# EAGLE design BATT_CPU_V4 (EAGLE 9.6.2)
COMPANY: ADAFRUIT INDUSTRIES; DRAWN: KTOWN; REV: B
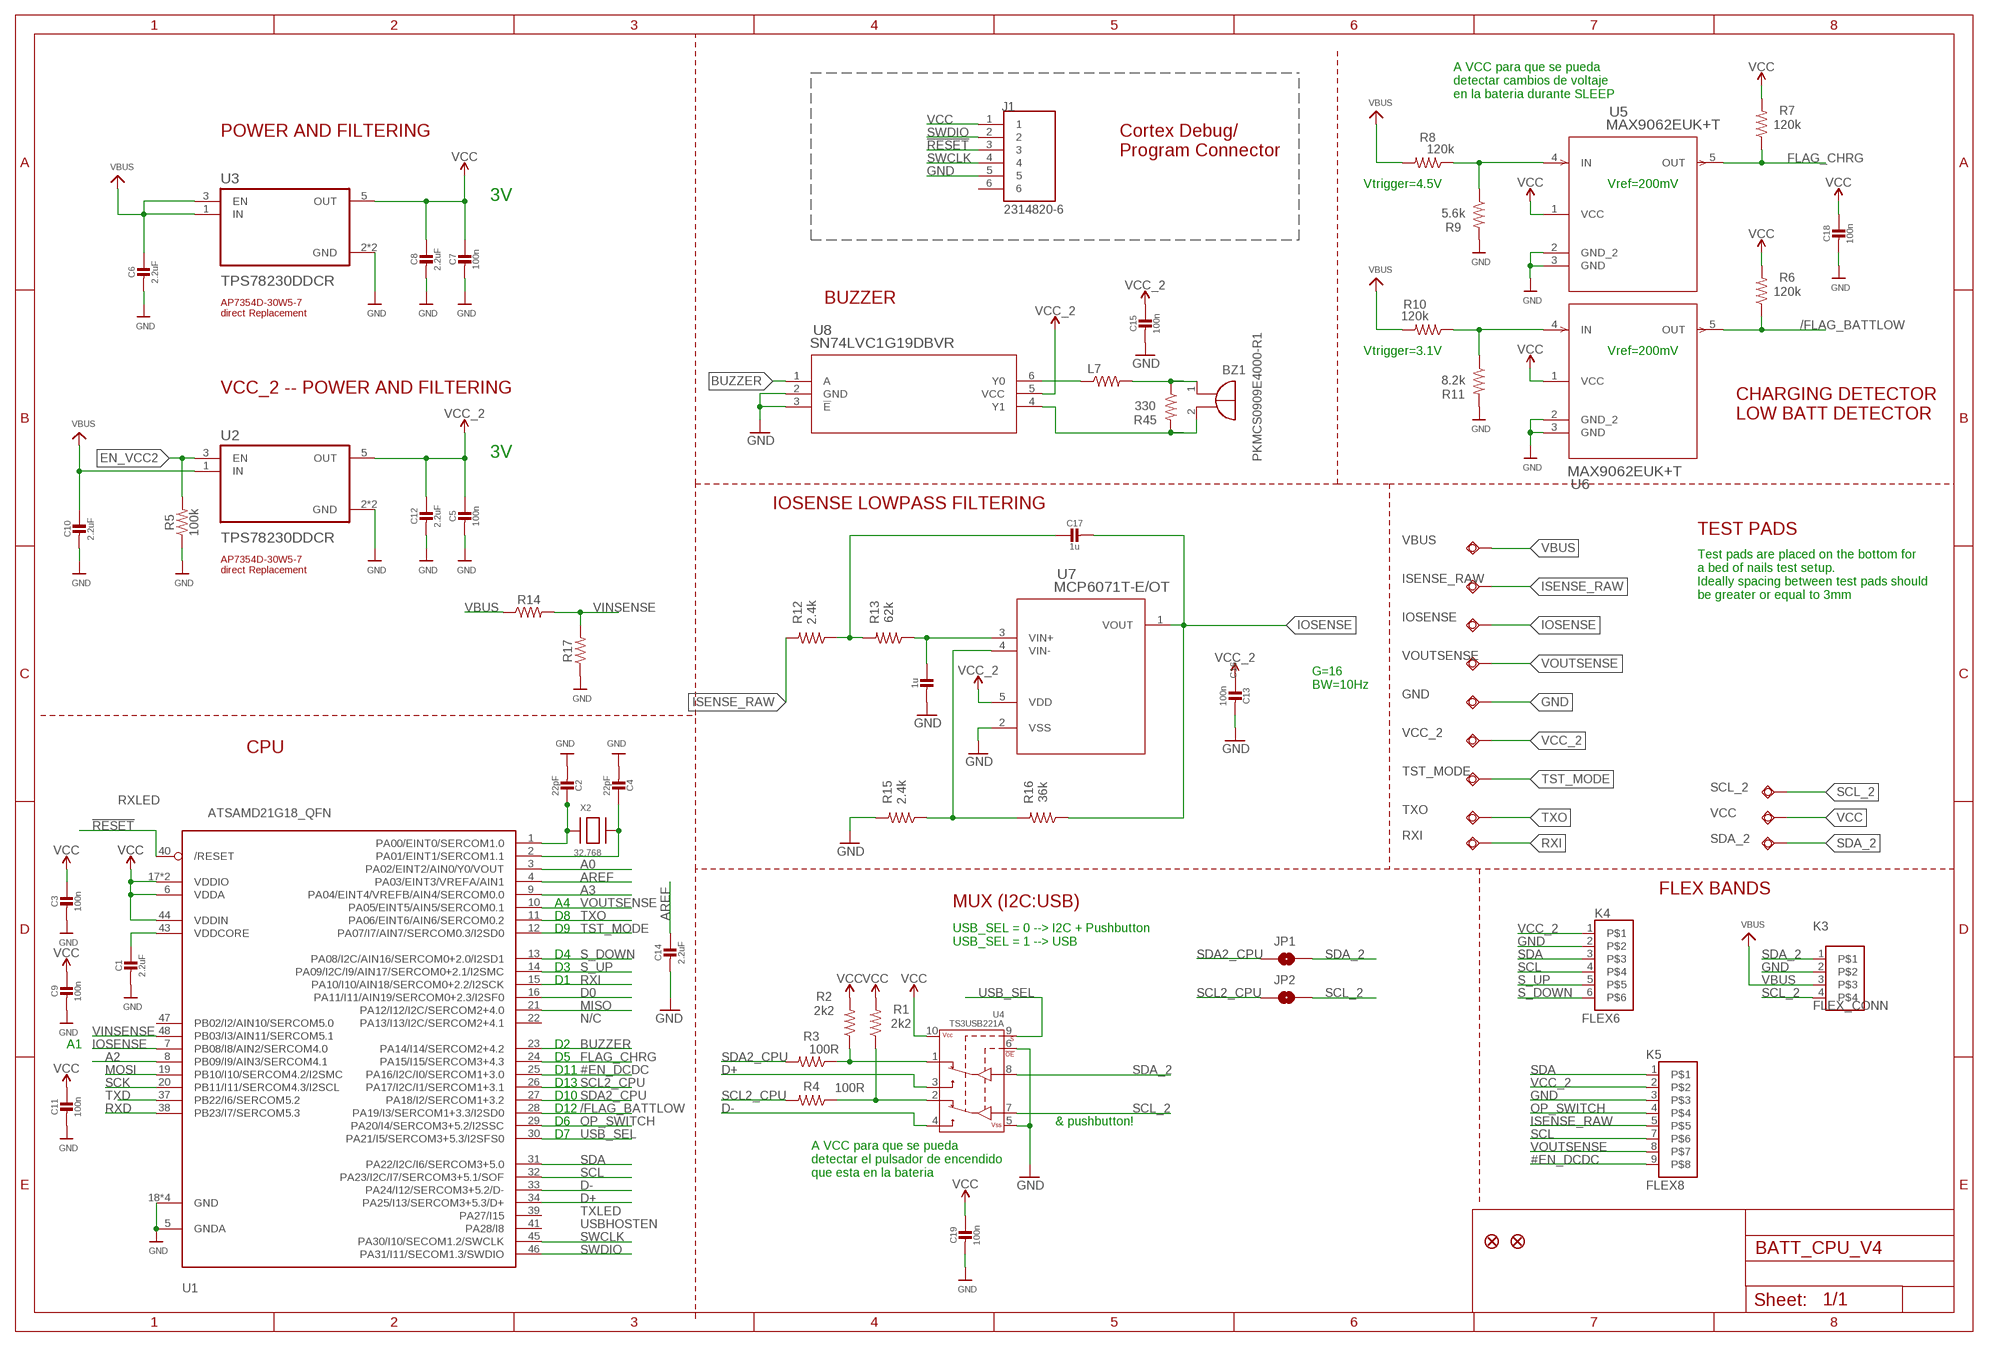
[diagram p0: schematic, sheet 1]

## Parts
BZ1  PKMCS0909E4000-R1  [PKMCS0909]
C1  2.2uF  CAP_CERAMIC0603_NO  [0603-NO]
C2  22pF  CAP_CERAMIC0603_NO  [0603-NO]
C3  100n  CAP_CERAMIC0603_NO  [0603-NO]
C4  22pF  CAP_CERAMIC0603_NO  [0603-NO]
C5  100n  CAP_CERAMIC0603_NO  [0603-NO]
C6  2.2uF  CAP_CERAMIC0805-NOOUTLINE  [0805-NO]
C7  100n  CAP_CERAMIC0603_NO  [0603-NO]
C8  2.2uF  CAP_CERAMIC0805-NOOUTLINE  [0805-NO]
C9  100n  CAP_CERAMIC0603_NO  [0603-NO]
C10  2.2uF  CAP_CERAMIC0805-NOOUTLINE  [0805-NO]
C11  100n  CAP_CERAMIC0603_NO  [0603-NO]
C12  2.2uF  CAP_CERAMIC0805-NOOUTLINE  [0805-NO]
C13  100n  CAP_CERAMIC0603_NO  [0603-NO]
C14  2.2uF  CAP_CERAMIC0603_NO  [0603-NO]
C15  100n  CAP_CERAMIC0603_NO  [0603-NO]
C16  1u  CAP_CERAMIC0603_NO  [0603-NO]
C17  1u  CAP_CERAMIC0603_NO  [0603-NO]
C18  100n  CAP_CERAMIC0603_NO  [0603-NO]
C19  100n  CAP_CERAMIC0603_NO  [0603-NO]
GND  TESTPAD_TPSQB1,27  [TESTPAD_B1,27]
IOSENSE  TESTPAD_TPSQB1,27  [TESTPAD_B1,27]
ISENSE_RAW  TESTPAD_TPSQB1,27  [TESTPAD_B1,27]
J1  2314820-6  [TE_2314820-6]
JP1  JUMPER-SMT_2_NO_SILK  [SMT-JUMPER_2_NO_SILK]
JP2  JUMPER-SMT_2_NO_SILK  [SMT-JUMPER_2_NO_SILK]
K3  FLEX_CONN  FLEX4  [FLEX4]
K4  FLEX6  [FLEX6]
K5  FLEX8  [FLEX8]
L7  MMZ2012Y202BT000  RESISTOR0805-RES  [0805]
R1  2k2  RESISTOR0603  [0603]
R2  2k2  RESISTOR0603  [0603]
R3  100R  RESISTOR0603  [0603]
R4  100R  RESISTOR0603  [0603]
R5  100k  RESISTOR0603  [0603]
R6  120k  RESISTOR0603  [0603]
R7  120k  RESISTOR0603  [0603]
R8  120k  RESISTOR0603  [0603]
R9  5.6k  RESISTOR0603  [0603]
R10  120k  RESISTOR0603  [0603]
R11  8.2k  RESISTOR0603  [0603]
R12  2.4k  RESISTOR0603  [0603]
R13  62k  RESISTOR0603  [0603]
R14  RESISTOR0603  [0603]
R15  2.4k  RESISTOR0603  [0603]
R16  36k  RESISTOR0603  [0603]
R17  RESISTOR0603  [0603]
R45  330  RESISTOR0603  [0603]
RXI  TESTPAD_TPSQB1,27  [TESTPAD_B1,27]
SCL_2  TESTPAD_TPSQB1,27  [TESTPAD_B1,27]
SDA_2  TESTPAD_TPSQB1,27  [TESTPAD_B1,27]
TST_MODE  TESTPAD_TPSQB1,27  [TESTPAD_B1,27]
TXO  TESTPAD_TPSQB1,27  [TESTPAD_B1,27]
U1  ATSAMD21G18_QFN  ATSAMD21J_QFN  [TQFN48_7MM]
U2  TPS78230DDCR  [SOT95P280X110-5N]
U3  TPS78230DDCR  [SOT95P280X110-5N]
U4  TS3USB221A  [QFN-10-RSE]
U5  MAX9062EUK+T  [21-0057F_MXM]
U6  MAX9062EUK+T  [21-0057F_MXM]
U7  MCP6071T-E/OT  [SOT-23-5_MC_MCH]
U8  SN74LVC1G19DBVR  [DBV6]
U$34  FIDUCIAL""  [FIDUCIAL_1MM]
U$35  FIDUCIAL""  [FIDUCIAL_1MM]
VBUS  TESTPAD_TPSQB1,27  [TESTPAD_B1,27]
VCC  TESTPAD_TPSQB1,27  [TESTPAD_B1,27]
VCC_2  TESTPAD_TPSQB1,27  [TESTPAD_B1,27]
VOUTSENSE  TESTPAD_TPSQB1,27  [TESTPAD_B1,27]
X2  32.768  XTAL-3.2X1.5  [XTAL3215]

## Nets
!RESET: J1.3 U1.40(/RESET)
#EN_DCDC: K5.9 U1.25(PA16/I2C/I0/SERCOM1+3.0)
/FLAG_BATTLOW: R6.1 U1.28(PA19/I3/SERCOM1+3.3/I2SD0) U6.5(OUT)
A0: U1.3(PA02/EINT2/AIN0/Y0/VOUT)
A2: U1.8(PB09/I9/AIN3/SERCOM4.1)
A3: U1.9(PA04/EINT4/VREFB/AIN4/SERCOM0.0)
AREF: C14.1 U1.4(PA03/EINT3/VREFA/AIN1)
BUZZER: U1.23(PA14/I14/SERCOM2+4.2) U8.1(A)
D0: U1.16(PA11/I11/AIN19/SERCOM0+2.3/I2SF0)
D+: U1.34(PA25/I13/SERCOM3+5.3/D+) U4.3(2D+)
D-: U1.33(PA24/I12/SERCOM3+5.2/D-) U4.4(2D-)
EN_VCC2: R5.2 U2.3(EN)
FLAG_CHRG: R7.1 U1.24(PA15/I15/SERCOM3+4.3) U5.5(OUT)
GND: C1.2 C2.2 C3.2 C4.2 C5.2 C6.2 C7.2 C8.2 C9.2 C10.2 C11.2 C12.2 C13.2 C14.2 C15.2 C16.2 C18.2 C19.2 GND.TP J1.5 K3.2 K4.2 K5.3 R5.1 R9.2 R11.2 R15.2 R17.1 U1.5(GNDA) U1.18(GND) U1.35(GND) U1.42(GND) U1.THERMAL(GND) U2.2(GND) U2.4(GND) U3.2(GND) U3.4(GND) U4.5(VSS) U4.6(!OE) U5.2(GND_2) U5.3(GND) U6.2(GND_2) U6.3(GND) U7.2(VSS) U8.2(GND) U8.3(!E)
IOSENSE: C17.2 IOSENSE.TP R16.1 U1.7(PB08/I8/AIN2/SERCOM4.0) U7.1(VOUT)
ISENSE_RAW: ISENSE_RAW.TP K5.5 R12.2
MISO: U1.21(PA12/I12/I2C/SERCOM2+4.0)
MOSI: U1.19(PB10/I10/SERCOM4.2/I2SMC)
N$1: R15.1 R16.2 U7.4(VIN-)
N$2: R2.1 R3.1 U4.1(1D+)
N$3: R1.1 R4.1 U4.2(1D-)
N$4: U1.37(PB22/I6/SERCOM5.2)
N$5: C2.1 U1.1(PA00/EINT0/SERCOM1.0) X2.P$1
N$6: U1.38(PB23/I7/SERCOM5.3)
N$7: C4.1 U1.2(PA01/EINT1/SERCOM1.1) X2.P$2
N$8: C17.1 R12.1 R13.2
N$10: R10.1 R11.1 U6.4(IN)
N$11: R8.1 R9.1 U5.4(IN)
N$13: C16.1 R13.1 U7.3(VIN+)
N$17: L7.1 U8.6(Y0)
N$19: BZ1.1(+) L7.2 R45.1
N$22: BZ1.2(-) R45.2 U8.4(Y1)
OP_SWITCH: K5.4 U1.29(PA20/I4/SERCOM3+5.2/I2SSC)
RXI: RXI.TP U1.15(PA10/I10/AIN18/SERCOM0+2.2/I2SCK)
S_DOWN: K4.6 U1.13(PA08/I2C/AIN16/SERCOM0+2.0/I2SD1)
S_UP: K4.5 U1.14(PA09/I2C/I9/AIN17/SERCOM0+2.1/I2SMC)
SCK: U1.20(PB11/I11/SERCOM4.3/I2SCL)
SCL: K4.4 K5.7 U1.32(PA23/I2C/I7/SERCOM3+5.1/SOF)
SCL2_CPU: JP2.1 R4.2 U1.26(PA17/I2C/I1/SERCOM1+3.1)
SCL_2: JP2.2 K3.4 SCL_2.TP U4.7(D-)
SDA: K4.3 K5.1 U1.31(PA22/I2C/I6/SERCOM3+5.0)
SDA2_CPU: JP1.1 R3.2 U1.27(PA18/I2/SERCOM1+3.2)
SDA_2: JP1.2 K3.1 SDA_2.TP U4.8(D+)
SWCLK: J1.4 U1.45(PA30/I10/SECOM1.2/SWCLK)
SWDIO: J1.2 U1.46(PA31/I11/SECOM1.3/SWDIO)
TST_MODE: TST_MODE.TP U1.12(PA07/I7/AIN7/SERCOM0.3/I2SD0)
TXO: TXO.TP U1.11(PA06/EINT6/AIN6/SERCOM0.2)
USB_SEL: U1.30(PA21/I5/SERCOM3+5.3/I2SFS0) U4.9(S)
VBUS: C6.1 C10.1 K3.3 R8.2 R10.2 R14.1 U2.1(IN) U3.1(IN) U3.3(EN) VBUS.TP
VCC: C3.1 C7.1 C8.1 C9.1 C11.1 C18.1 C19.1 J1.1 R1.2 R2.2 R6.2 R7.2 U1.6(VDDA) U1.17(VDDIO) U1.36(VDDIO) U1.44(VDDIN) U3.5(OUT) U4.10(VCC) U5.1(VCC) U6.1(VCC) VCC.TP
VCC_2: C5.1 C12.1 C13.1 C15.1 K4.1 K5.2 U2.5(OUT) U7.5(VDD) U8.5(VCC) VCC_2.TP
VDDCORE: C1.1 U1.43(VDDCORE)
VINSENSE: R14.2 R17.2 U1.48(PB03/I3/AIN11/SERCOM5.1)
VOUTSENSE: K5.8 U1.10(PA05/EINT5/AIN5/SERCOM0.1) VOUTSENSE.TP
Unconnected: J1.6 U1.22(PA13/I13/I2C/SERCOM2+4.1) U1.39(PA27/I15) U1.41(PA28/I8) U1.47(PB02/I2/AIN10/SERCOM5.0)

## Notes on the sheet
- A VCC para que se pueda
  detectar cambios de voltaje
  en la bateria durante SLEEP
- Cortex Debug/
  Program Connector
- POWER AND FILTERING
- Vtrigger=4.5V | Vref=200mV
- 3V
- BUZZER
- AP7354D-30W5-7 
  direct Replacement
- Vtrigger=3.1V | Vref=200mV
- VCC_2 -- POWER AND FILTERING
- CHARGING DETECTOR
  LOW BATT DETECTOR
- 3V
- IOSENSE LOWPASS FILTERING
- TEST PADS
- AP7354D-30W5-7 
  direct Replacement
- Test pads are placed on the bottom for
  a bed of nails test setup.
  Ideally spacing between test pads should 
  be greater or equal to 3mm
- G=16
  BW=10Hz
- CPU
- RXLED
- FLEX BANDS
- A4 | MUX (I2C:USB)
- D8
- D9
- USB_SEL = 0 --> I2C + Pushbutton
  USB_SEL = 1 --> USB
- D4
- D3
- D1
- N/C
- A1 | D2
- D5
- D11
- D13
- TXD | D10
- RXD | D12
- D6 | & pushbutton!
- D7
- A VCC para que se pueda
  detectar el pulsador de encendido
  que esta en la bateria
- TXLED
- USBHOSTEN

## Library data of the parts
BZ1 = buzzer:PKMCS0909E4000-R1: PKMCS0909E4000-R1 Source : http://www.murata.com/~/media/webrenewal/products/sound/sounder/vppt-buzj083-d.ashx
C1-C19 = microbuilder:CAP_CERAMIC: Ceramic Capacitors For new designs, use the packages preceded by an '_' character since they are more reliable: The following footprints should be used on most boards: _0402 - Standard footprint for regular board layouts _0603 - Standard footprint for regular board layouts _0805 - Standard footprint for regular board layouts _1206 - Standard footprint for regular board layouts For extremely tight-pitch boards where space is at a premium, the following 'micro-pitch' footprints can be used (smaller pads, no silkscreen outline, etc.): _0402MP - Micro-pitch footprint for very dense/compact boards _0603MP - Micro-pitch footprint for very dense/compact boards _0805MP - Micro-pitch footprint for very dense/compact boards _1206MP - Micro-pitch footprint for very dense/compact boards
GND IOSENSE ISENSE_RAW RXI SCL_2 SDA_2 TST_MODE TXO VBUS VCC VCC_2 VOUTSENSE = BeagleBone_Blue_R3:TESTPAD_TPSQ: Test pad
J1 = connector 2x3-2mm:2314820-6; COMMENT: 2314820-6; DESCRIPTION: Socket Receptacle 6P,2MM,B-B,REC,DRVT,2.7,0.1AU,TB 6 POS; DIGI-KEY_PART_NUMBER: 17-2314820-6-ND; MF: TE Connectivity; MP: 2314820-6; PACKAGE: None; PURCHASE-URL: https://pricing.snapeda.com/search/part/2314820-6/?ref=eda
JP1 JP2 = SparkFun-Jumpers:JUMPER-SMT_2_NO: Normally open jumper This jumper has two pads in close proximity to each other. Apply solder to close the connection. Round pads are easier to solder for beginners, but are a lot larger. SparkFun Product that uses the round pads: SparkFun EL Sequencer <https://www.sparkfun.com/products/12781>
K3 = Flex_3mm:FLEX4
K4 = Flex_3mm:FLEX6: WR-FPC 1mm SMT Horiz. Bot. Contact Hinge type WR-FPC 1mm 06 pins Hinge type SMT Horizontal Bottom Contact ;=>Code : Con_FPC_ZIF_1.00_6861xx148922_686106148922 <http://katalog.we-online.de/media/images/eican/Con_FPC_ZIF_1.00_686110148922_pf2.jpg> Details see: http://katalog.we-online.de/em/datasheet/6861xx148922.pdf Created 2014-10-08, Karrer Zheng 2014 (C) Wurth Elektronik
K5 = Flex_3mm:FLEX8: WR-FPC 1mm SMT Horiz. Bot. Contact Hinge type WR-FPC 1mm 08 pins Hinge type SMT Horizontal Bottom Contact ;=>Code : Con_FPC_ZIF_1.00_6861xx148922_686108148922 <http://katalog.we-online.de/media/images/eican/Con_FPC_ZIF_1.00_686110148922_pf2.jpg> Details see: http://katalog.we-online.de/em/datasheet/6861xx148922.pdf Created 2014-10-08, Karrer Zheng 2014 (C) Wurth Elektronik
L7 = SparkFun:RESISTOR: Resistor Basic schematic elements and footprints for 0603, 1206, and PTH resistors.
R1-R17 R45 = SparkFun-Resistors:RESISTOR: Generic Resistor Package
U1 = microbuilder:ATSAMD21J
U2 U3 = TPS78230DDCR:TPS78230DDCR: Check prices <https://pricing.snapeda.com/parts/TPS78230DDCR/Texas%20Instruments/view-part?ref=eda>; AVAILABILITY: Good; DESCRIPTION: 150-mA, nano-IQ, low-dropout voltage regulator with enable from -40C to +125C 5-SOT-23-THIN -40 to 125; MF: Texas Instruments; MP: TPS78230DDCR; PACKAGE: SOT-23-THN-5 Texas Instruments; PRICE: None; PURCHASE-URL: https://pricing.snapeda.com/search/part/TPS78230DDCR/?ref=eda
U4 = SparkFun-IC-Special-Function:TS3USB221A: DPDT Analog Mux DPDT Analog Mux Vcc 2.5 to 3.3V Passes up to 5.5V at 3.3V supply 900MHz BW, 6Ω switch resistance SparkFun Products SparkFun FTDI SmartBasic <https://www.sparkfun.com/products/12935> (DEV-12935); PROD_ID: IC-12115
U5 U6 = MAX9062:MAX9062EUK+T; BUILT_BY: EMA_UL_Team; MANUFACTURER_PART_NUMBER: MAX9062EUK+T; SOURCELIBRARY: Maxim_2014-06-20; VENDOR: Maxim Integrated Products
U7 = MCP6071:MCP6071T-E/OT; BUILT_BY: EMA_Jessica; COPYRIGHT: Copyright (C) 2018 Accelerated Designs. All rights reserved; MANUFACTURER_PART_NUMBER: MCP6071T-E/OT; SOURCELIBRARY: Microchip_2019-08-23_21; VENDOR: Microchip
U8 = SN74LVC1G19DBVR:SN74LVC1G19DBVR; DATASHEET_URL: http://www.ti.com/lit/gpn/SN74LVC1G19; DESCRIPTION: 1-of-2 Decoder/Demultiplexer; FAMILY_NAME: LL Decoder, Mux/Demux; GENERIC_PART_NUMBER: SN74LVC1G19; INDUSTRY_STD_PKG_TYPE: SOT-23; MANUFACTURER: Texas Instruments; MANUFACTURER_PART_NUMBER: SN74LVC1G19DBVR; PACKAGE_DESIGNATOR: DBV; PIN_COUNT: 6; VENDOR: Texas Instruments
U$34 U$35 = microbuilder:FIDUCIAL: Fiducial Alignment Points Various fiducial points for machine vision alignment.; BOM: EXCLUDE
X2 = adafruit2:XTAL: Low cost SMT crystals, no capacitors included http://www.ladyada.net/library/eagle

## Net classes
2 gnd: width 0.305 mm, drill 0.483 mm, clearance 0.203 mm

## Board
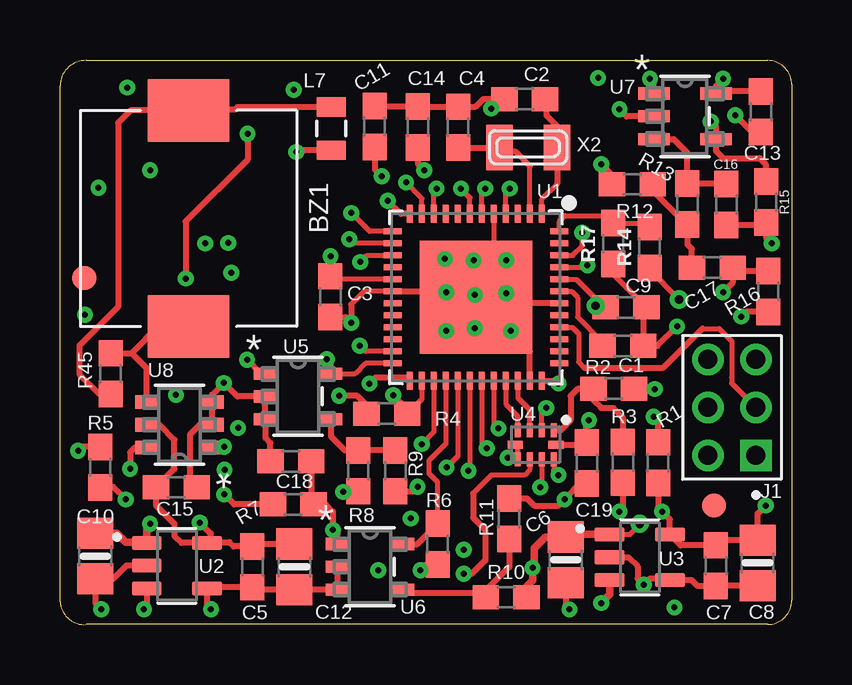
[diagram p1: board, top side]
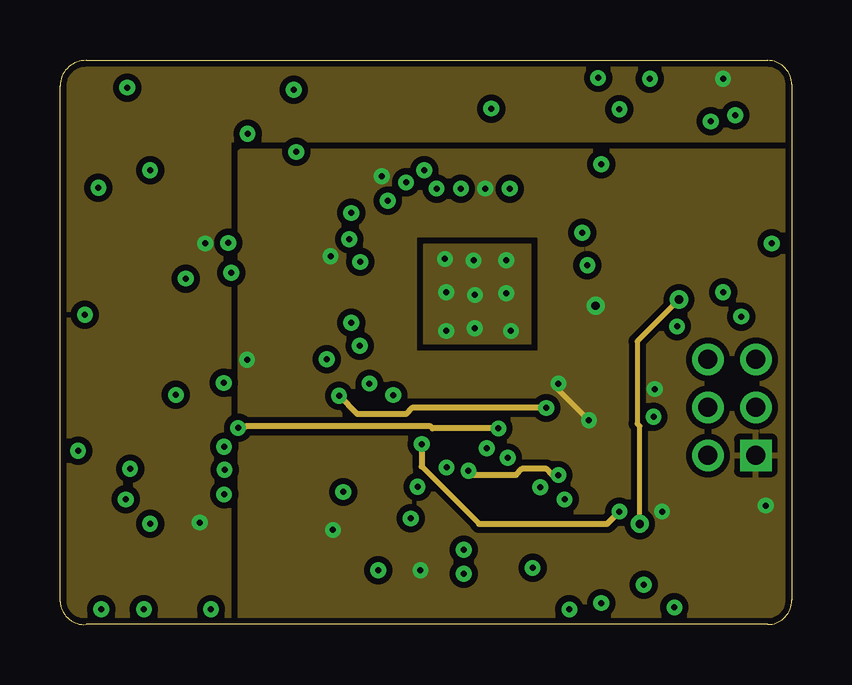
[diagram p2: board, inner layer Route2]
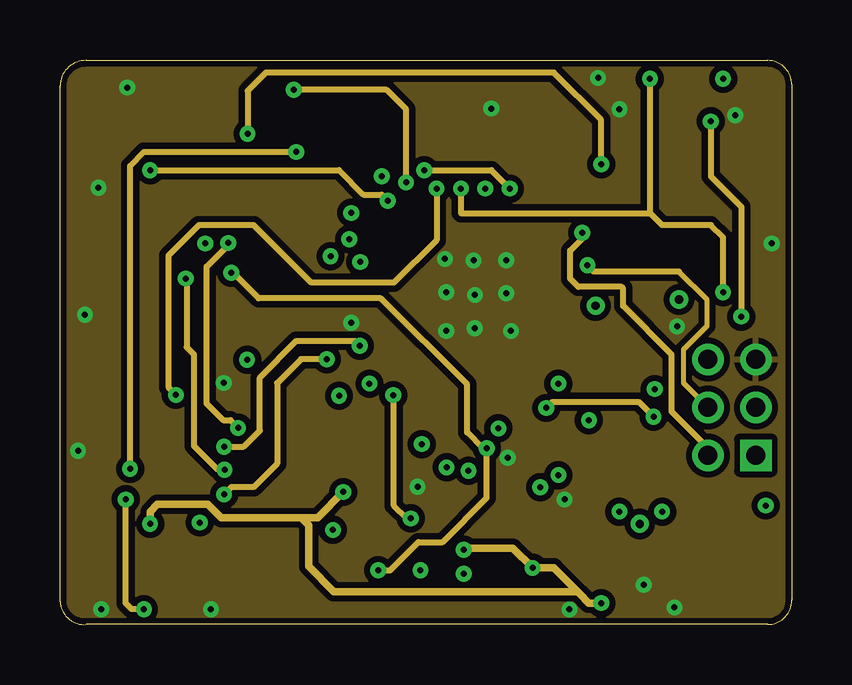
[diagram p3: board, inner layer Route15]
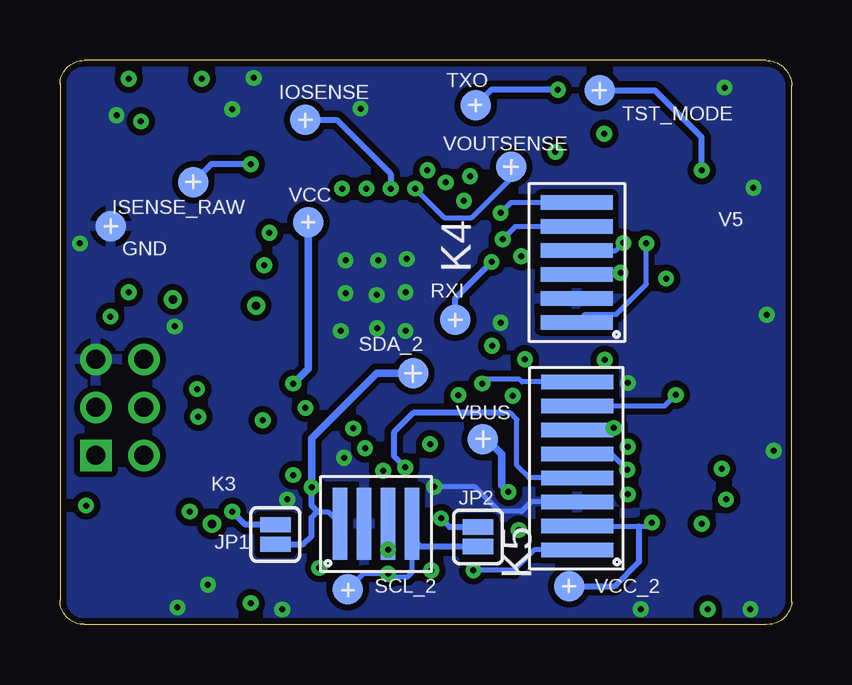
[diagram p4: board, bottom side, seen from below]

Size 30.49 x 23.5 mm. Coordinates in mm from the lower left corner, seen from the top.
Outline: 1.09,23.5 29.49,23.5 arc-90 30.49,22.5 30.49,1 arc-90 29.49,0 1.09,0 arc-90 0,0.95 0,22.45 arc-90 1.09,23.5
Copper layers (1+2*15+16): Top 0.035mm / dielectric 1.5mm / Route2 0.035mm / dielectric 0.15mm / Route15 0.035mm / dielectric 0.2mm / Bottom 0.035mm
Design rules "adafruit *": minimum track width 8mil, minimum drill 0.25mm, track to track 10mil, track to pad 10mil, pad to pad 10mil, via to via 10mil, smd to smd 8mil, copper to edge 10mil, drill to drill 8mil, minimum pad ring 10mil, minimum via ring 8mil, stop-mask expansion 2mil, vias tented up to drill 20mil, thermal gap 10mil

### Footprints (pad centres in the part's own frame; a part is rotated, then mirrored left to right if it is on the bottom)
PKMCS0909 = smd 2.6 x 3.4: 1 -4.5,0; 2 4.5,0
0603-NO = smd 1.1 x 1: 1 -0.85,0; 2 0.85,0
0805-NO = smd 1.3 x 1.5: 1 -0.95,0; 2 0.95,0
TESTPAD_B1,27 = smd 1.27 x 1.27: TP 0,0
TE_2314820-6 = drill 0.8 pad 1.15 square: 1 0,0 | drill 0.8 pad 1.15: 2 0,2; 3 2,0; 4 2,2; 5 4,0; 6 4,2
SMT-JUMPER_2_NO_SILK = smd 0.635 x 1.27: 1 -0.406,0; 2 0.406,0
FLEX4 = smd 0.6 x 3: 1 0.3,1.85; 2 1.3,1.85; 3 2.3,1.85; 4 3.3,1.85
FLEX6 = smd 0.6 x 3: 1 -2.5,-0.35; 2 -1.5,-0.35; 3 -0.5,-0.35; 4 0.5,-0.35; 5 1.5,-0.35; 6 2.5,-0.35
FLEX8 = smd 0.6 x 3: 1 0.8,2.05; 2 1.8,2.05; 3 2.8,2.05; 4 3.8,2.05; 5 4.8,2.05; 7 5.8,2.05; 8 6.8,2.05; 9 7.8,2.05
0805 = smd 0.8 x 1.2: 1 -0.9,0; 2 0.9,0
0603 = smd 1.1 x 1: 1 -0.85,0; 2 0.85,0
TQFN48_7MM = smd 0.25 x 0.75: 1 -2.75,-3.475; 2 -2.25,-3.475; 3 -1.75,-3.475; 4 -1.25,-3.475; 5 -0.75,-3.475; 6 -0.25,-3.475; 7 0.25,-3.475; 8 0.75,-3.475; 9 1.25,-3.475; 10 1.75,-3.475; 11 2.25,-3.475; 12 2.75,-3.475; 25 2.75,3.475; 26 2.25,3.475; 27 1.75,3.475; 28 1.25,3.475; 29 0.75,3.475; 30 0.25,3.475; 31 -0.25,3.475; 32 -0.75,3.475; 33 -1.25,3.475; 34 -1.75,3.475; 35 -2.25,3.475; 36 -2.75,3.475 | smd 0.75 x 0.25: 13 3.475,-2.75; 14 3.475,-2.25; 15 3.475,-1.75; 16 3.475,-1.25; 17 3.475,-0.75; 18 3.475,-0.25; 19 3.475,0.25; 20 3.475,0.75; 21 3.475,1.25; 22 3.475,1.75; 23 3.475,2.25; 24 3.475,2.75; 37 -3.475,2.75; 38 -3.475,2.25; 39 -3.475,1.75; 40 -3.475,1.25; 41 -3.475,0.75; 42 -3.475,0.25; 43 -3.475,-0.25; 44 -3.475,-0.75; 45 -3.475,-1.25; 46 -3.475,-1.75; 47 -3.475,-2.25; 48 -3.475,-2.75 | smd 4.7 x 4.7: THERMAL 0,0
SOT95P280X110-5N = smd 1.25 x 0.59: 1 -1.255,0.95; 2 -1.255,0; 3 -1.255,-0.95; 4 1.255,-0.95; 5 1.255,0.95
QFN-10-RSE = smd 0.58 x 0.25: 1 -0.6,0.75; 2 -0.6,0.25; 3 -0.6,-0.25; 4 -0.6,-0.75; 6 0.6,-0.75; 7 0.6,-0.25; 8 0.6,0.25; 9 0.6,0.75 | smd 0.35 x 0.63: 5 0,-0.85; 10 0,0.85
21-0057F_MXM = smd 0.972 x 0.508: 1 -1.362,0.95; 2 -1.362,0; 3 -1.362,-0.95; 4 1.362,-0.95; 5 1.362,0.95
SOT-23-5_MC_MCH = smd 1.31 x 0.508: 1 -1.295,0.95; 2 -1.295,0; 3 -1.295,-0.95; 4 1.295,-0.95; 5 1.295,0.95
DBV6 = smd 0.972 x 0.568: 1 -1.362,0.95; 2 -1.362,0; 3 -1.362,-0.95; 4 1.362,-0.95; 5 1.362,0; 6 1.362,0.95
FIDUCIAL_1MM = smd 1 x 1: 1 0,0
XTAL3215 = smd 1.1 x 1.9: P$1 1.2,0; P$2 -1.2,0

### Placement (x,y rotation side)
BZ1  5.36,16.92 270 top
C1  23.45,11.61 0 top
C2  19.37,21.9 180 top
C3  11.26,13.66 270 top
C4  16.59,20.73 90 top
C5  8.02,2.4 270 top
C6  21.07,2.69 270 top
C7  27.32,2.45 270 top
C8  29.07,2.57 270 top
C9  23.58,13.21 0 top
C10  1.47,2.85 270 top
C11  13.12,20.75 90 top
C12  9.77,2.4 270 top
C13  29.2,21.37 270 top
C14  14.91,20.73 90 top
C15  4.85,5.71 0 top
C16  27.77,17.5 270 top
C17  27.18,14.86 0 top
C18  9.62,6.8 180 top
C19  21.95,6.73 270 top
GND  28.37,16.59 0 bottom
IOSENSE  20.26,21.03 0 bottom
ISENSE_RAW  24.93,18.44 0 bottom
J1  28.99,7.05 90 top
JP1  21.52,3.75 270 bottom
JP2  13.07,3.65 270 bottom
K3  19.12,2.35 0 bottom
K4  9.31,15.08 90 bottom
K5  6.89,2.31 90 bottom
L7  11.3,20.66 90 top
R1  24.92,6.75 270 top
R2  23.07,9.82 0 top
R3  23.45,6.76 270 top
R4  13.62,8.79 0 top
R5  1.67,6.55 270 top
R6  15.73,3.35 270 top
R7  9.72,5 0 top
R8  12.42,6.4 270 top
R9  13.97,6.4 270 top
R10  18.59,1.13 0 top
R11  18.72,4.41 90 top
R12  23.85,18.35 180 top
R13  26.14,17.52 270 top
R14  24.57,15.71 90 top
R15  29.42,17.6 270 top
R16  29.5,13.88 270 top
R17  23.06,15.87 90 top
R45  2.12,10.45 90 top
RXI  14.02,12.7 0 bottom
SCL_2  18.51,1.46 0 bottom
SDA_2  15.78,10.46 0 bottom
TST_MODE  8,22.25 0 bottom
TXO  13.17,21.63 0 bottom
U1  17.33,13.63 180 top
U2  4.87,2.45 0 top
U3  24.16,2.8 0 top
U4  19.82,7.49 270 top
U5  9.92,9.5 0 top
U6  12.92,2.4 0 top
U7  26.04,21.17 0 top
U8  4.98,8.32 180 top
U$34  27.26,4.97 90 top
U$35  1.01,14.44 0 top
VBUS  12.87,7.73 0 bottom
VCC  20.15,16.75 0 bottom
VCC_2  9.28,1.6 0 bottom
VOUTSENSE  11.69,19.08 0 bottom
X2  19.51,19.88 0 top

### Tracks (layer width: path | path; a pad name or v marks a point on that pad's centre or on a via)
!RESET
  Top 0.203: J1.3 27.98,10.06 27.98,10.29 27.99,10.3 27.99,11.81 27.48,12.32 26.76,12.32 | U1.40 21.35,12.38 21.61,12.12 21.61,10.94 21.83,10.71
  Top 0.254: 21.83,10.71 25.15,10.71 26.76,12.32
#EN_DCDC  (via drill 0.25)
  Top 0.254: U1.25 14.56,10.16 14.42,10.29 13.15,10.29 v12.9,10.04
  Bottom 0.203: K5.9 11.24,10.11 11.34,10.21 12.72,10.21 v12.9,10.04
/FLAG_BATTLOW
  Top 0.203: R6.1 15.73,5.93 15.39,6.28 15.39,6.84 16.08,7.53 U1.28
  Top 0.254: U6.5 14.88,3.35 R6.1
AREF  (via drill 0.25)
  Top 0.203: U1.4 18.58,18.01
  Top 0.254: 18.58,18.01 v18.74,18.17 | C14.1 14.91,19.2 v15.18,18.93
  Route15 0.254: v15.18,18.93 17.98,18.93 v18.74,18.17
BUZZER  (via drill 0.25)
  Top 0.203: U1.23 12.72,11.38 v12.49,11.61
  Top 0.254: U8.1 6.8,7.37 v6.84,7.41
  Route15 0.254: v6.84,7.41 7.66,7.41 8.32,8.08 8.32,10.29 9.85,11.82 12.28,11.82 v12.49,11.61
D+
  Top 0.203: U1.34 19.08,9.44 19.56,8.96 19.56,8.19 19.57,8.18 U4.3
D-
  Top 0.203: U1.33 18.58,9.18 19.06,8.7 U4.4
EN_VCC2  (via drill 0.25)
  Top 0.254: U2.3 3.61,0.76 v3.5,0.64 | R5.2 1.69,5.72 2.23,5.72 v2.74,5.21
  Route15 0.254: v3.5,0.64 2.99,0.64 2.74,0.89 v2.74,5.21
FLAG_CHRG  (via drill 0.25)
  Top 0.203: U1.24 12.72,10.88 12.29,10.45 U5.5
  Top 0.254: U5.5 11.28,10.89 v11.12,11.05 | R7.1 7.25,5 v6.84,5.42
  Route15 0.254: v11.12,11.05 10.05,11.05 9.05,10.06 9.05,6.7 8.07,5.72 7.14,5.72 v6.84,5.42
GND  (via drill 0.25)
  Top 0.203: U1.18 12.67,13.88 12.13,13.34 | U1.5 18.08,14.38 | U4.6 19.07,7.39 | C9.2 23.06,14.58 R17.1
  Top 0.254: C15.2 5.42,5.99 5.42,7.92 5.82,8.32 U8.2 U8.3 6.34,9.58 v6.83,10.07 7.39,9.5 U5.2 U5.3 8.56,7.77 8.77,7.56 C18.2 | C8.2 27.33,1.62 C7.2 26.56,1.6 26.31,1.85 U3.4 25.4,1.85 25.34,1.91 24.58,1.91 v24.33,1.66 24.07,1.91 24.07,2.42 23.69,2.8 U3.2 | C6.2 21.07,0.79 v21.23,0.63 | U6.2 U6.3 C12.2 8.12,1.45 C5.2 6.17,1.55 U2.4 6.12,0.81 v6.29,0.64 | v1.72,0.64 1.47,0.89 C10.2 2.23,1.91 2.77,2.45 U2.2 | R5.1 0.81,7.4 0.75,7.34 v0.75,7.24 | U1.18 17.08,13.88 U1.THERMAL | C3.2 11.9,12.81 v12.13,12.58 12.13,13.34 | U1.35 19.58,11.38 U1.THERMAL | U1.42 17.58,13.38 U1.THERMAL | 18.08,14.38 U1.THERMAL | U7.2 23.61,21.17 v23.31,21.47 | C11.2 14.89,21.6 C14.2 C4.2 17.32,21.58 17.64,21.9 C2.2 18.36,21.9 v17.97,21.5 | v29.66,15.88 29.42,16.12 R15.2 29.32,16.65 C16.2 | C13.2 28.96,20.52 28.9,20.45 v28.14,21.21 | 19.07,7.39 U4.5 | U4.6 19.07,6.91 18.99,6.99 18.69,6.99 v18.65,6.95 | C19.2 21.69,5.88 v21.02,5.21 20.77,4.96 19.75,4.96 19.46,5.26 R11.2 | v25.71,12.42 24.89,11.61 C1.2 24.3,13.08 C9.2 | R9.2 14.71,5.55 v14.9,5.74
  Bottom 0.203: K5.3 10.86,5.11 11.26,4.71 12.18,4.71 13.21,5.74 v14.9,5.74
  other vias: 16.04,15.23 18.59,15.18 18.79,12.23 16.09,12.23 16.09,13.84 17.28,12.34 18.59,13.8 17.29,13.73 17.23,15.17 22.42,22.77 25.6,0.71 1.04,12.9 1.6,18.2 2.8,22.37
  pour Bottom: -0.89,23.65 30.56,23.65 30.56,0.08 -0.89,0.08
  pour Route2: 15.18,15.84 19.6,15.84 19.6,11.69 15.17,11.69 15.17,15.83
  pour Route15 (isolate 0.254, rank 2): -0.2,23.82 -0.76,23.26 -0.76,-0.81 30.84,-0.81 30.84,24.14 -0.2,24.14
IOSENSE  (via drill 0.25)
  Top 0.203: U1.7 17.08,17.79 v16.71,18.17
  Top 0.254: R16.1 28.16,14.73 C17.2 28.03,14.25 v27.63,13.85 | U7.1 24.74,22.57 v24.58,22.74
  Route15 0.254: v27.63,13.85 27.63,16.13 27.12,16.64 25.09,16.64 24.6,17.13 | v24.58,22.74 24.58,17.15 24.6,17.13 | v16.71,18.17 16.71,17.15 16.72,17.13 24.6,17.13
  Bottom 0.254: IOSENSE.TP 18.96,21.03 16.71,18.77 v16.71,18.17
ISENSE_RAW  (via drill 0.25)
  Top 0.254: R12.2 23,18.73 v22.55,19.18 | v7.82,20.45 7.82,19.37 5.24,16.8 v5.24,14.42
  Route15 0.254: v22.55,19.18 22.55,21.02 20.58,22.99 8.58,22.99 7.82,22.23 v7.82,20.45 | v5.24,14.42 5.28,14.38 5.28,11.56 5.58,11.25 5.58,7.44 6.58,6.45 v6.86,6.45
  Bottom 0.203: v6.86,6.45 7.52,7.11 K5.5
  Bottom 0.254: v22.55,19.18 24.19,19.18 ISENSE_RAW.TP
N$1  (via drill 0.25)
  Top 0.254: R15.1 29.41,18.47 29.41,19.18 29.15,19.44 27.63,19.44 27.33,19.73 U7.4 27.33,20.75 v27.12,20.96 | R16.2 28.59,13.03 v28.39,12.83
  Route15 0.254: v27.12,20.96 27.12,18.67 28.39,17.4 v28.39,12.83
N$2
  Top 0.254: R3.1 23.45,8.62 23.06,9.02 22.55,9.02 22.22,9.35 R2.1 21.57,9.82 21.28,9.53 21.28,8.51 20.86,8.09 U4.1
N$3  (via drill 0.25)
  Top 0.203: U4.2 20.07,8.83 v20.26,9.02
  Top 0.254: R4.1 12.77,9.15 12.39,9.53 v11.63,9.53 | R1.1 24.92,8.47 v24.73,8.66
  Route2 0.254: v20.26,9.02 14.67,9.02 14.42,8.77 12.39,8.77 v11.63,9.53
  Route15 0.254: v20.26,9.02 20.52,9.28 24.11,9.28 v24.73,8.66
N$5
  Top 0.203: U1.1 20.08,17.73 20.71,18.36
  Top 0.254: 20.71,18.36 X2.P$1 20.71,20.77 20.26,21.21 20.26,21.98 20.22,21.93 C2.1
N$7
  Top 0.203: U1.2 19.58,19.1
  Top 0.254: 19.58,19.1 18.99,19.69 18.5,19.69 X2.P$2 C4.1
N$8
  Top 0.254: C17.1 26.33,15.65 26.14,15.84 R13.2 26.1,16.67 24.7,18.07 R12.1
N$10
  Top 0.254: R11.1 18.72,2.4 17.74,1.42 R10.1 | R10.1 | R10.1 17.57,1.3 14.43,1.3 U6.4
N$11
  Top 0.254: R9.1 R8.1 11.87,7.25 11.28,7.84 U5.4
N$13
  Top 0.254: C16.1 27.75,18.37 R13.1 26.14,19.65 25.57,20.22 U7.3
N$17  (via drill 0.25)
  Top 0.254: L7.1 9.92,19.76 v9.85,19.69 | U8.6 3.12,7.37 2.92,7.17 v2.92,6.49
  Route15 0.254: v9.85,19.69 3.5,19.69 2.92,19.11 v2.92,6.49
N$19
  Top 0.254: L7.2 7.4,21.56 7.31,21.47 5.53,21.47 5.48,21.42 BZ1.1 2.94,21.42 2.42,20.9 2.42,13.23 0.81,11.62 0.81,10.44 1.65,9.6 R45.1
N$22
  Top 0.254: R45.2 2.98,11.3 | BZ1.2 4.1,12.42 2.98,11.3 | U8.4 3.62,10.67 2.98,11.3
OP_SWITCH  (via drill 0.25)
  Top 0.203: U1.29 16.58,7.02 v16.11,6.55
  Bottom 0.203: K5.4 10.94,6.11 11.45,6.62 11.45,8.55 11.72,8.82 12.03,8.82
  Bottom 0.254: 12.03,8.82 15.77,8.82 16.58,8.01 16.58,7.02 v16.11,6.55
RXI  (via drill 0.25)
  Top 0.203: U1.15 13.83,15.36 12.76,15.36 v12.51,15.11
  Bottom 0.254: RXI.TP 14.02,13.6 v12.51,15.11
S_DOWN  (via drill 0.25)
  Top 0.203: U1.13 12.9,16.38 v12.13,17.15
  Bottom 0.203: K4.6 11.7,17.58 v12.13,17.15
S_UP  (via drill 0.25)
  Top 0.203: U1.14 12.22,15.88
  Top 0.254: v12.05,16.05 12.22,15.88
  Bottom 0.203: v12.05,16.05 11.52,16.58 K4.5
SCL  (via drill 0.25)
  Top 0.203: U1.32 18.08,8.36 v18.27,8.17
  Route2 0.203: 7.75,8.26 7.49,8.26 v7.42,8.19
  Route2 0.254: v18.27,8.17 15.53,8.17 15.44,8.26 7.75,8.26
  Route15 0.254: v7.01,15.9 7.01,15.81 6.11,14.91 6.11,9.2 6.8,8.51 7.1,8.51 v7.42,8.19
  Bottom 0.203: K4.4 7.33,15.58 v7.01,15.9 | K5.7 8.79,7.96 7.65,7.96 v7.42,8.19
SCL2_CPU  (via drill 0.25)
  Top 0.203: U1.26 15.08,9.4 R4.2
  Top 0.254: R4.2 14.47,8.98 v13.89,9.56
  Route15 0.254: v14.61,4.42 14.45,4.42 13.91,4.96 13.91,9.54 v13.89,9.56
  Bottom 0.254: JP2.1 14.25,4.06 v14.61,4.42
SCL_2  (via drill 0.25)
  Top 0.203: U4.7 19.57,6.44 19.36,6.23 17.98,6.23 17.21,5.47
  Top 0.254: 17.21,5.47 17.21,4.45 17.72,3.94 17.72,2.67 17.17,2.12 v16.82,2.12
  Bottom 0.203: SCL_2.TP 17.85,2.12 v16.82,2.12 16.69,1.99 16.01,1.99 15.82,2.18 K3.4 15.82,3.62 15.45,3.25
  Bottom 0.254: JP2.2 15.45,3.25
SDA  (via drill 0.25)
  Top 0.203: U1.31 17.58,7.55 v17.78,7.35
  Route15 0.254: v13.26,2.26 13.75,2.26 14.93,3.43 15.94,3.43 17.78,5.27 v17.78,7.35 17.62,7.35 16.96,8.01 16.96,10.01 13.37,13.59 8.28,13.59 7.22,14.65 v7.13,14.65
  Bottom 0.203: K4.3 7.2,14.58 v7.13,14.65 | K5.1 10.73,3.11 11.58,2.26 v13.26,2.26
SDA2_CPU  (via drill 0.25)
  Top 0.203: U1.27 15.58,8.03 v15.07,7.52
  Top 0.254: R3.2 23.45,4.85 v23.31,4.7
  Route2 0.203: 15.07,6.59 17.47,4.2
  Route2 0.254: v15.07,7.52 15.07,6.59 | 17.47,4.2 22.8,4.2 v23.31,4.7
  Bottom 0.254: v23.31,4.7 22.76,4.16 JP1.1
SDA_2  (via drill 0.25)
  Top 0.203: v20.01,5.72 20.07,5.78 U4.8
  Bottom 0.203: K3.1 19.29,4.67 19.79,4.67
  Bottom 0.254: JP1.2 20.35,3.35 20.01,3.69 20.01,4.45 19.79,4.67 19.79,4.74 20.01,4.96 v20.01,5.72
  Bottom 0.305: v20.01,5.72 20.01,7.75 17.3,10.46 SDA_2.TP
SWCLK  (via drill 0.25)
  Top 0.203: v21.98,14.97 21.89,14.88 U1.45
  Route15 0.203: J1.4 25.98,10.06 25.98,11.47 26.96,12.44 26.96,13.53 25.79,14.71
  Route15 0.254: 25.79,14.71 22.24,14.71 v21.98,14.97
SWDIO  (via drill 0.25)
  Top 0.203: U1.46 21.37,15.38 21.76,15.77 v21.76,16.32
  Route15 0.254: J1.2 26.99,7.37 25.49,8.87 25.49,11.24 23.46,13.27 23.46,14 23.39,14.07 21.6,14.07 21.26,14.41 21.26,15.58 21.76,16.08 v21.76,16.32
TST_MODE  (via drill 0.25)
  Top 0.254: U1.12 14.21,17.11 v13.66,17.66
  Route15 0.254: v3.75,18.93 11.63,18.93 12.64,17.91 13.4,17.91 v13.66,17.66
  Bottom 0.254: TST_MODE.TP 5.7,22.25 3.75,20.3 v3.75,18.93
TXO  (via drill 0.25)
  Top 0.203: U1.11 15.08,17.76 v14.42,18.42
  Route15 0.254: v14.42,18.42 14.42,21.47 13.61,22.28 v9.74,22.28
  Bottom 0.254: TXO.TP 12.53,22.28 v9.74,22.28
USB_SEL  (via drill 0.25)
  Top 0.203: U1.30 17.08,6.47 | U4.9 20.57,6.43 v20.77,6.23
  Top 0.254: 17.08,6.47 v17.02,6.41
  Route2 0.254: v20.77,6.23 20.52,6.23 20.26,6.48 19.25,6.48 18.99,6.23 17.2,6.23 v17.02,6.41
VBUS  (via drill 0.25, 0.35)
  Top 0.203: U3.1 23.75,3.75 24.16,4.16 v24.16,4.19 | v25.79,13.54 v25.79,13.55 24.57,14.77 R14.1
  Top 0.254: 3.58,3.43 U2.1 | 21.18,3.75 C6.1
  Top 0.305: C10.1 2.37,3.8 2.74,3.43 3.58,3.43 | U3.1 21.18,3.75 | R10.2 19.44,1.6 19.69,1.85 v19.69,2.36 19.75,2.42 19.75,3.18 20.22,3.64 C6.1 | U2.1 3.61,4.06 v3.75,4.2 | R8.2 11.83,5.55 v11.8,5.52 | U3.3 22.9,1.25 v22.55,0.89
  Route2 0.203: v24.16,4.19 24.16,8.26 24.05,8.38 24.05,11.8 v25.79,13.54
  Route15 0.254: 21.66,1.28 21.56,1.37
  Route15 0.305: v3.75,4.2 3.75,4.7 4.06,5.01 6.16,5.01 6.72,4.45 10.05,4.45 | 10.05,4.45 10.73,4.45 v11.8,5.52 | v22.55,0.89 22.04,0.89 21.66,1.28 20.58,2.36 v19.69,2.36 18.87,3.18 16.89,3.18 v16.82,3.11 | 21.56,1.37 11.4,1.37 10.36,2.42 10.36,4.15 10.05,4.45
  Bottom 0.203: K3.3 16.82,3.17 16.79,3.14
  Bottom 0.254: 12.84,7.75 VBUS.TP
  Bottom 0.305: 16.79,3.14 v16.82,3.11 | 12.84,7.75 12.73,7.75 12.08,7.09 12.08,5.8 v11.8,5.52
VCC  (via drill 0.25, 0.35)
  Top 0.203: U1.17 11.39,14.38 | U1.44 21.51,14.38 22.68,13.21 C9.1 22.39,13.21 v22.32,13.28 | U1.6 17.58,18.02
  Top 0.254: v29.41,4.96 29.07,4.62 C8.1 27.53,3.52 C7.1 25.86,3.3 U3.5 25.41,4.38 v25.09,4.7 24.92,4.87 R1.2 | v11.27,15.35 v11.26,15.33 C3.1 11.39,14.38 | U5.1 8.37,10.45 v7.79,11.03 | C18.1 10.47,5.1 R7.2 11.07,5 11.37,4.7 v11.37,3.94 11.56,3.76 U6.1 | R6.2 15.26,2.5 v15.02,2.26 | C11.1 13.12,18.96 v13.4,18.67 | 17.58,18.02 v17.72,18.17 | v22.04,8.51 21.94,8.41 21.94,7.48 21.95,7.49 21.87,7.49 | U4.10 21.87,7.49 | 21.87,7.49 C19.1 | R2.2 24.77,9.82 v24.78,9.81 | U1.36 20.65,10.16 v20.77,10.04
  Route2 0.203: v22.04,8.51 20.77,9.78 v20.77,10.04
  Bottom 0.305: v20.77,10.04 20.15,10.66 VCC.TP
  pour Route2 (rank 2): 30.77,19.69 7.51,19.69 7.51,-0.48 30.77,-0.48
VCC_2  (via drill 0.25)
  Top 0.203: U8.5 4.15,8.32
  Top 0.254: 4.15,8.32 4.77,7.7 4.77,6.48 C15.1 4,4.96 4.77,4.2 4.77,3.69 5.05,3.4 U2.5 6.26,3.4 6.29,3.43 | 6.29,3.43 7.05,3.43 7.24,3.25 C5.1 8.12,3.35 C12.1 | 6.29,3.43 6.29,3.79 v5.83,4.25 | C13.1 27.43,22.22 U7.5 27.33,22.45 v27.63,22.74
  Bottom 0.203: K4.1 8.62,12.93 7.31,12.93 6.06,14.18 v6.06,15.88 | K5.2 8.92,4.09 6.4,4.09 5.99,4.09
  Bottom 0.254: 6.4,4.09 6.37,4.09 6.37,2.61 7.38,1.6 VCC_2.TP | 5.99,4.09 v5.83,4.25
  pour Route2 (rank 2): 7,-0.12 -0.35,-0.12 -0.35,23.75 30.42,23.75 30.42,20.2 7,20.2
VDDCORE
  Top 0.203: U1.43 21.32,13.88 21.57,13.63 21.57,12.82 22.6,11.78 C1.1
VINSENSE
  Top 0.203: R14.2 24.41,16.72 R17.2 22.75,17.03 21.04,17.03 20.8,16.8 U1.48
VOUTSENSE  (via drill 0.25)
  Top 0.203: U1.10 15.58,18.06
  Top 0.254: 15.58,18.06 v15.69,18.17
  Route15 0.254: v15.69,18.17 15.69,16.02 13.91,14.24 10.47,14.24 8.07,16.64 5.78,16.64 4.51,15.37 4.51,9.89 v4.83,9.57
  Bottom 0.203: VOUTSENSE.TP 11.69,18.6 13.36,16.93 14.46,16.93 v15.69,18.17 | K5.8 5.29,9.11 v4.83,9.57

### Text on the board
bNames: V5